# Altium project mainboard.PrjPcb
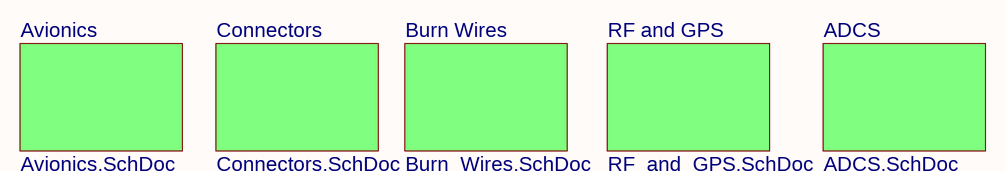
[diagram p0: mainboard.SchDoc]
6 sheets, 87 parts. Net scope: flat (ports and power ports of the same name join across sheets).
Board file: mainboard.PcbDoc
Sheets:
  mainboard.SchDoc
    Avionics = Avionics.SchDoc
    Connectors = Connectors.SchDoc
    Burn Wires = Burn_Wires.SchDoc
    RF and GPS = RF_and_GPS.SchDoc
    ADCS = ADCS.SchDoc

## Sheet mainboard.SchDoc
size 297 x 210 mm

### Sub-sheets
ADCS = ADCS.SchDoc: no entries
Avionics = Avionics.SchDoc: no entries
Burn Wires = Burn_Wires.SchDoc: no entries
Connectors = Connectors.SchDoc: no entries
RF and GPS = RF_and_GPS.SchDoc: no entries

### Notes on the sheet
- 1
- 2
- 3
- 4
- 5
- 6
- A
- B
- C
- D
- Title: PyCubed Mainboard
- File: mainboard.sch
- Sheet: /
- Max Holliday
- KiCad E.D.A.  kicad (5.1.4)-1
- Size: A4
- Date: 2020-02-10
- Rev: v04
- Id: 1/6

## Sheet Avionics.SchDoc
size 297 x 210 mm
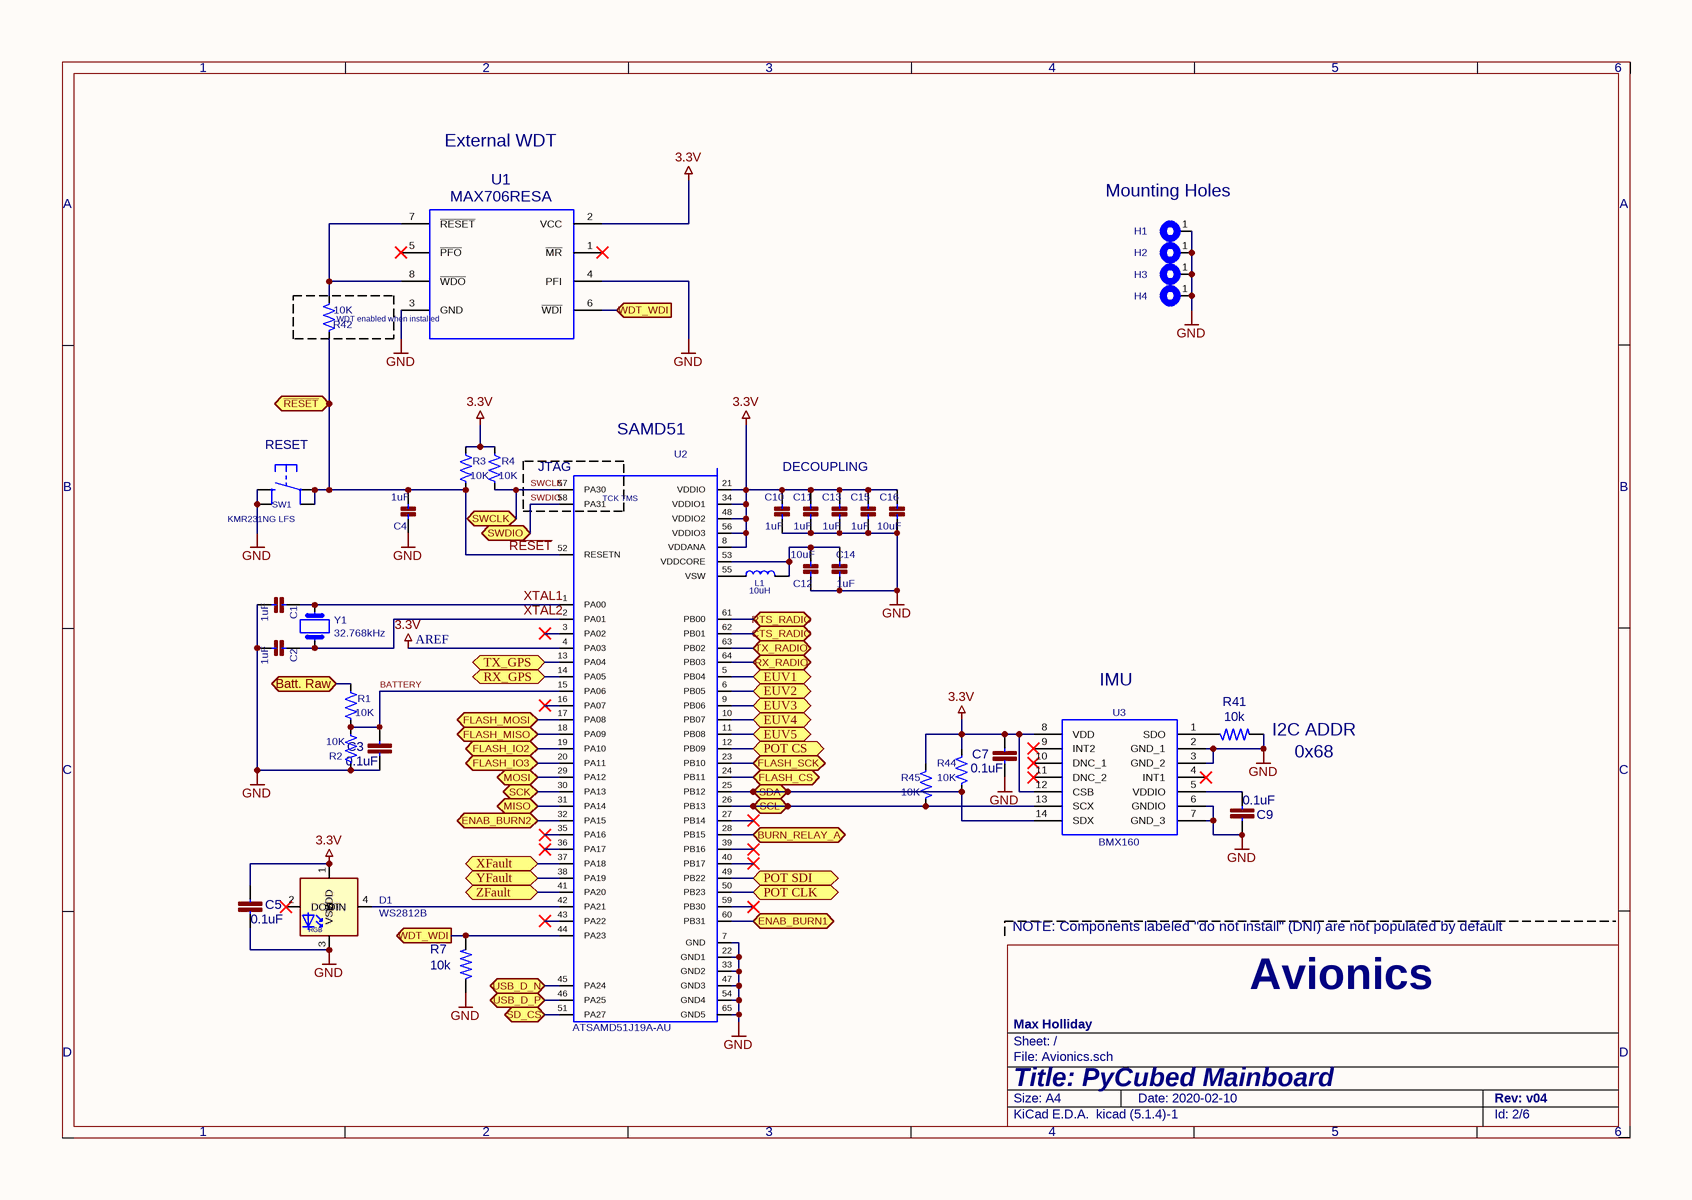
[diagram p1: Avionics.SchDoc]

### Parts
C1  1uF  [C_0603_1608Metric]
C2  1uF  [C_0603_1608Metric]
C3  0.1uF  [C_0603_1608Metric]
C4  1uF  [C_0603_1608Metric]
C5  0.1uF  [C_0603_1608Metric]
C7  0.1uF  [C_0603_1608Metric]
C9  0.1uF  [C_0603_1608Metric]
C10  1uF  [C_0603_1608Metric]
C11  1uF  [C_0603_1608Metric]
C12  10uF  [C_0603_1608Metric]
C13  1uF  [C_0603_1608Metric]
C14  1uF  [C_0603_1608Metric]
C15  1uF  [C_0603_1608Metric]
C16  10uF  [C_0603_1608Metric]
D1  WS2812B  [LED_WS2812B_PLCC4_5.0x5.0mm_P3.2mm]
H1  MountingHole_Pad  [MountingHole_3.2mm_M3_DIN965_Pad]  (value not drawn)  (no BOM)
H2  MountingHole_Pad  [MountingHole_3.2mm_M3_DIN965_Pad]  (value not drawn)  (no BOM)
H3  MountingHole_Pad  [MountingHole_3.2mm_M3_DIN965_Pad]  (value not drawn)  (no BOM)
H4  MountingHole_Pad  [MountingHole_3.2mm_M3_DIN965_Pad]  (value not drawn)  (no BOM)
L1  10uH  [L_0805_2012Metric_Pad1.15x1.40mm_HandSolder]
R1  10K  [R_0603_1608Metric]
R2  10K  [R_0603_1608Metric]
R3  10K  [R_0603_1608Metric]
R4  10K  [R_0603_1608Metric]
R7  10k  [R_0603_1608Metric]
R41  10k  [R_0603_1608Metric]
R42  10K  [R_0603_1608Metric]
R44  10K  [R_0603_1608Metric]
R45  10K  [R_0603_1608Metric]
SW1  KMR231NG LFS  [BTN_KMR2_4.6X2.8]
U1  MAX706RESA  [SO-8_3.9x4.9mm_P1.27mm]
U2  Proto: ATSAMD51J19A-AU  [ATSAMD51J19A-MU]  (hidden comment: 120MHZ 512KB Flash 64 TQFP)
U3  BMX160  [BMX160]
Y1  32.768kHz  [Crystal_SMD_3215-2Pin_3.2x1.5mm]

### Blocks framed on the sheet
WDT enabled / when installed: R42

### Ports
Batt. Raw (bidir), BURN_RELAY_A (bidir), CTS_RADIO (bidir), ENAB_BURN1 (bidir), ENAB_BURN2 (bidir), EUV1 (bidir), EUV2 (bidir), EUV3 (bidir), EUV4 (bidir), EUV5 (bidir), FLASH_CS (bidir), FLASH_IO2 (bidir), FLASH_IO3 (bidir), FLASH_MISO (bidir), FLASH_MOSI (bidir), FLASH_SCK (bidir), MISO (bidir), MOSI (bidir), POT CLK (bidir), POT CS (bidir), POT SDI (bidir), RTS_RADIO (bidir), RX_GPS (bidir), RX_RADIO (bidir), SCK (bidir), SCL (bidir), SD_CS (bidir), SDA (bidir), SWCLK (bidir), SWDIO (bidir), TX_GPS (bidir), TX_RADIO (bidir), USB_D_N (bidir), USB_D_P (bidir), WDT_WDI (in), WDT_WDI (out), XFault (bidir), YFault (bidir), ZFault (bidir), ~{RESET} (bidir)

### Nets
3.3V: C5.1 C7.1 C10.1 C11.1 C13.1 C15.1 C16.1 D1.1(VDD) R3.1 R4.1 R44.1 R45.1 U1.2(VCC) U2.4(PA03) U2.8(VDDANA) U2.21(VDDIO) U2.34(VDDIO1) U2.48(VDDIO2) U2.56(VDDIO3) U3.8(VDD) U3.12(CSB)
GND: C1.2 C2.2 C3.2 C4.1 C5.2 C7.2 C9.1 C10.2 C11.2 C12.1 C13.2 C14.2 C15.2 C16.2 D1.3(VSS) H1.1 H2.1 H3.1 H4.1 R2.1 R7.1 R41.2 SW1.B(S) SW1.B'(S1) U1.3(GND) U1.4(PFI) U2.7(GND) U2.22(GND1) U2.33(GND2) U2.47(GND3) U2.54(GND4) U2.65(GND5) U3.2(GND_1) U3.3(GND_2) U3.6(GNDIO) U3.7(GND_3)
Batt. Raw: R1.1 ; port Batt. Raw
BATTERY: C3.1 R1.2 R2.2 U2.15(PA06)
BURN_RELAY_A: U2.28(PB15) ; port BURN_RELAY_A
CTS_RADIO: U2.62(PB01) ; port CTS_RADIO
ENAB_BURN1: U2.60(PB31) ; port ENAB_BURN1
ENAB_BURN2: U2.32(PA15) ; port ENAB_BURN2
EUV5: U2.11(PB08) ; port EUV5
FLASH_CS: U2.24(PB11) ; port FLASH_CS
FLASH_IO2: U2.19(PA10) ; port FLASH_IO2
FLASH_IO3: U2.20(PA11) ; port FLASH_IO3
FLASH_MISO: U2.18(PA09) ; port FLASH_MISO
FLASH_MOSI: U2.17(PA08) ; port FLASH_MOSI
FLASH_SCK: U2.23(PB10) ; port FLASH_SCK
GB01: U2.5(PB04) ; port EUV1
GB02: U2.6(PB05) ; port EUV2
GB03: U2.9(PB06) ; port EUV3
GB04: U2.10(PB07) ; port EUV4
MISO: U2.31(PA14) ; port MISO
MOSI: U2.29(PA12) ; port MOSI
POT CLK: U2.50(PB23) ; port POT CLK
POT CS: U2.12(PB09) ; port POT CS
POT SDI: U2.49(PB22) ; port POT SDI
~{RESET}: C4.2 R3.2 R42.1 SW1.A(P) SW1.A'(P1) U2.52(RESETN) ; port ~{RESET}
RTS_RADIO: U2.61(PB00) ; port RTS_RADIO
RX_GPS: U2.14(PA05) ; port RX_GPS
RX_RADIO: U2.64(PB03) ; port RX_RADIO
SCK: U2.30(PA13) ; port SCK
SCL: R45.2 U2.26(PB13) U3.13(SCX) ; port SCL
SD_CS: U2.51(PA27) ; port SD_CS
SDA: R44.2 U2.25(PB12) U3.14(SDX) ; port SDA
SWCLK: R4.2 U2.57(PA30) ; port SWCLK
SWDIO: U2.58(PA31) ; port SWDIO
TX_GPS: U2.13(PA04) ; port TX_GPS
TX_RADIO: U2.63(PB02) ; port TX_RADIO
USB_D_N: U2.45(PA24) ; port USB_D_N
USB_D_P: U2.46(PA25) ; port USB_D_P
WDT_WDI: R7.2 U1.6(~{WDI}) U2.44(PA23) ; port WDT_WDI
XFault: U2.37(PA18) ; port XFault
XTAL1: C1.1 U2.1(PA00) Y1.1
XTAL2: C2.1 U2.2(PA01) Y1.2
YFault: U2.38(PA19) ; port YFault
ZFault: U2.41(PA20) ; port ZFault
NetC9_2: C9.2 U3.5(VDDIO)
NetC12_2: C12.2 C14.1 L1.1 U2.53(VDDCORE)
NetD1_4: D1.4(DIN) U2.42(PA21)
NetL1_2: L1.2 U2.55(VSW)
NetR41_1: R41.1 U3.1(SDO)
NetR42_2: R42.2 U1.7(~{RESET}) U1.8(~{WDO})

Not connected (* = marked no-connect by the designer): D1 2(DOUT)*; U1 1(~{MR})* 5(~{PFO})*; U2 3(PA02)* 16(PA07)* 27(PB14)* 35(PA16)* 36(PA17)* 39(PB16)* 40(PB17)* 43(PA22)* 59(PB30)*; U3 4(INT1)* 9(INT2)* 10(DNC_1)* 11(DNC_2)*

### Notes on the sheet
- External WDT
- (near H1) Mounting Holes
- (near SW1) RESET
- (near U2) JTAG
- (near U2) TCK
  TMS
- (near U2) SAMD51
- DECOUPLING
- AREF
- (near U3) IMU
- 0x68
- (near R41) I2C ADDR
- NOTE: Components labeled "do not install" (DNI) are not populated by default
- Avionics
- 1
- 2
- 3
- 4
- 5
- 6
- A
- B
- C
- D
- Title: PyCubed Mainboard
- File: Avionics.sch
- Sheet: /
- Max Holliday
- KiCad E.D.A.  kicad (5.1.4)-1
- Size: A4
- Date: 2020-02-10
- Rev: v04
- Id: 2/6
- (in symbol WS2812B) RGB

### Library data of the parts
C1 C2 C4 C10 C11 C13-C15 = CAP_CERAMIC0603_NO-Adafruit_Feather_M4_Express-eagle-import-lab64_SAM32-rescue-SAMD-10-rescue-SAM32-rescue: MPN: CL10A105KB8NNNC; Value: 1uF; Footprint: Capacitor_SMD:C_0603_1608Metric
C3 C5 C7 C9 = 0.1UF-25V(+80_-20%)(0603): MPN: CL10B104KB8NNNL; Value: 0.1uF; Footprint: Capacitor_SMD:C_0603_1608Metric
C12 C16 = CAP_CERAMIC0805-NOOUTLINE-Adafruit_Feather_M4_Express-eagle-import-lab64_SAM32-rescue-SAMD-10-rescue-SAM32-rescue: MPN: CL10A106MP8NNNC; Value: 10uF; Footprint: Capacitor_SMD:C_0603_1608Metric
D1 = WS2812B: MPN: COM-16347; Proto: WS2812B; Value: WS2812B; Footprint: LED_SMD:LED_WS2812B_PLCC4_5.0x5.0mm_P3.2mm
L1 = INDUCTOR-Adafruit_Feather_M4_Express-eagle-import-lab64_SAM32-rescue-SAMD-10-rescue-SAM32-rescue: MPN: LBR2012T100K; Value: 10uH; Footprint: Inductor_SMD:L_0805_2012Metric_Pad1.15x1.40mm_HandSolder
R1-R4 R42 R44 R45 = R_US: MPN: CRGCQ0603J10K; Value: 10K; Footprint: Resistor_SMD:R_0603_1608Metric
R7 R41 = R-US_R0603: MPN: RNCP0603FTD10K0; Value: 10k; Footprint: Resistor_SMD:R_0603_1608Metric
SW1 = SWITCH_TACT_SMT4.6X2.8-Adafruit_Feather_M4_Express-eagle-import-lab64_SAM32-rescue-SAMD-10-rescue-SAM32-rescue: Value: KMR231NG LFS; Footprint: Adafruit Feather M4 Express:BTN_KMR2_4.6X2.8; MPN: KMR231NG LFS
U1 = MAX708RESA-T: Proto: MAX706RESA; Value: MAX706RESA; Footprint: Package_SO:SO-8_3.9x4.9mm_P1.27mm; MPN: MAX706RESA
U2 = ATSAMD51J20A-AU-ATSAMD51J20A-AU-lab64_SAM32-rescue-lab64_SAM32-rescue-SAMD-10-rescue-SAM32-rescue: Field4: 120MHZ 512KB Flash 64 TQFP PKG inTray 85CTemp, 64 TQFP 10x10x1mm TRAY; Field5: TQFP-64 Microchip; Value: 120MHZ 512KB Flash 64 TQFP; Footprint: custom-footprints:QFP50P1200X1200X120-64N; MPN: ATSAMD51J19A-AU
Y1 = Crystal: Proto: ABS07-32.768KHZ-T; Value: 32.768kHz; Footprint: Crystal:Crystal_SMD_3215-2Pin_3.2x1.5mm; MPN: ABS07-32.768KHZ-T
H1-H4 = MountingHole_Pad: Value: MountingHole_Pad; Footprint: MountingHole:MountingHole_3.2mm_M3_DIN965_Pad
U3 = BMX160: Proto: BMX160; Value: BMX160; Footprint: custom-footprints:BMX160; MPN: BMX160

## Sheet Connectors.SchDoc
size 297 x 210 mm
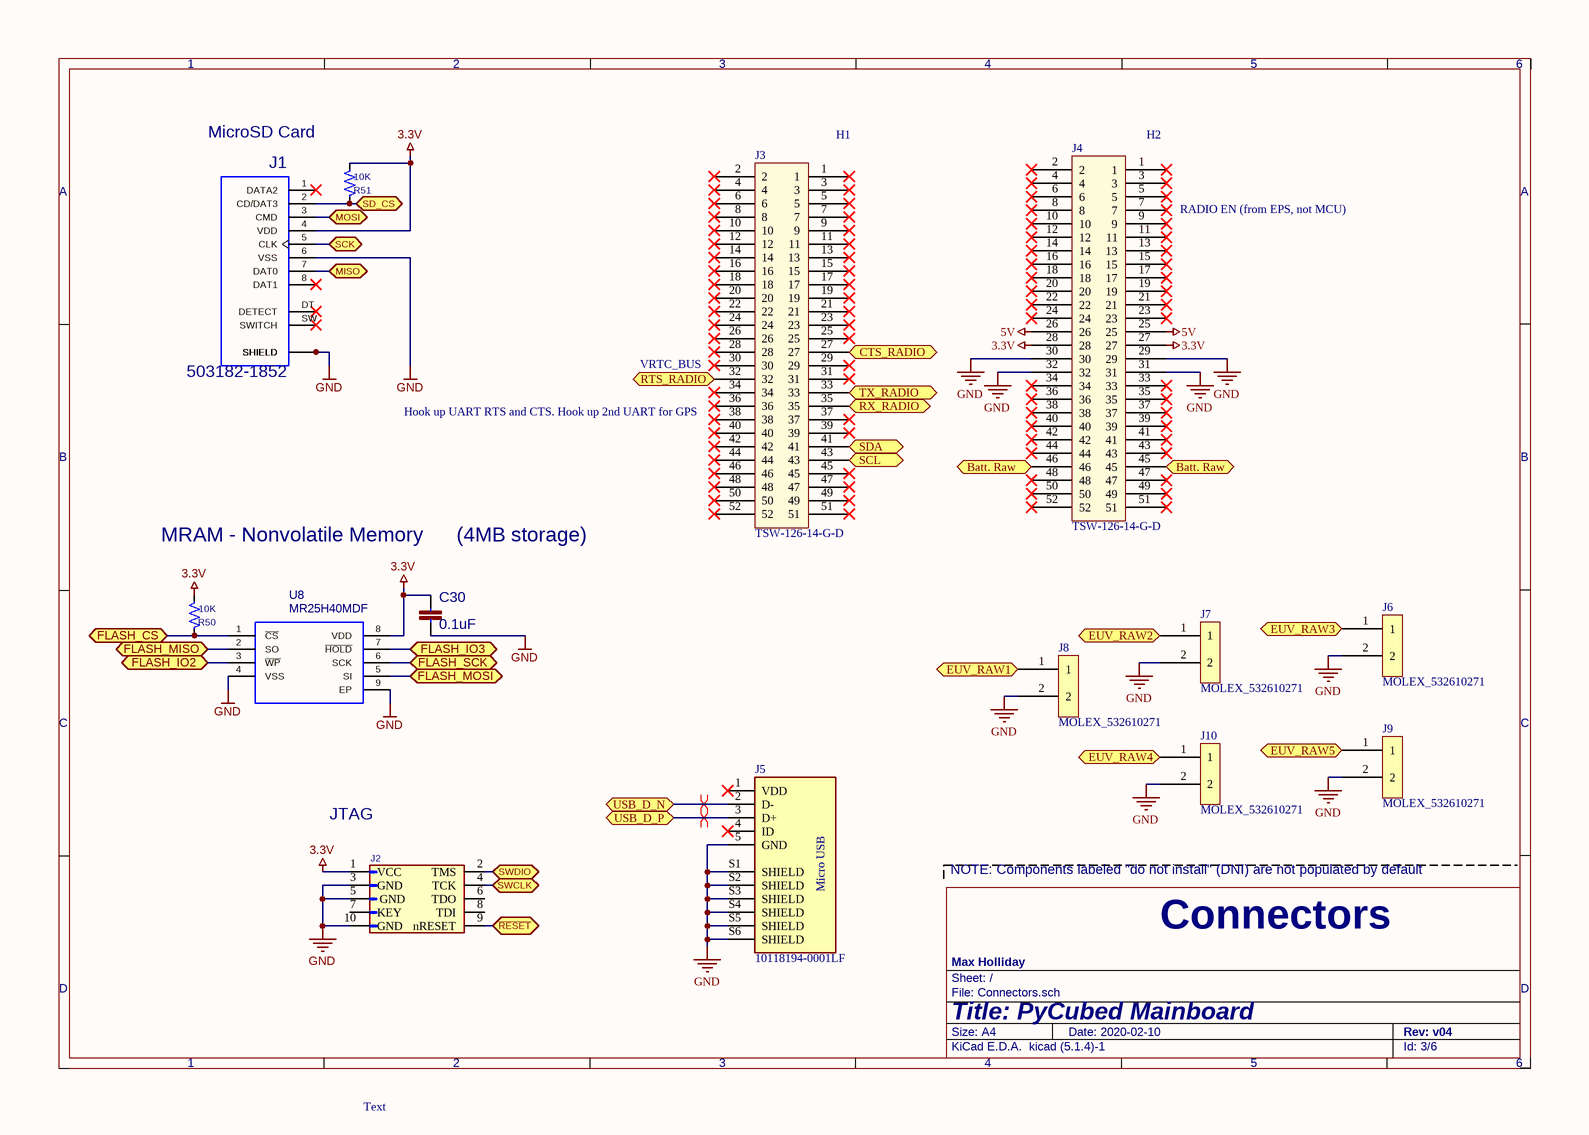
[diagram p2: Connectors.SchDoc]

### Parts
C30  0.1uF  [C_0603_1608Metric]
J1  503182-1852  [MOLEX_503182-1852]
J2  Conn_01x05  [PinHeader_1x05_P2.54mm_Vertical]  (value not drawn)  (no BOM)
J3  TSW-126-14-G-D  [SAMTEC_TSW-126-14-G-D]
J4  TSW-126-14-G-D  [SAMTEC_TSW-126-14-G-D]
J5  10118194-0001LF  [AMPHENOL_10118194-0001LF]
J6  MOLEX_532610271  [Molex_PicoBlade_532610271]
J7  MOLEX_532610271  [Molex_PicoBlade_532610271]
J8  MOLEX_532610271  [Molex_PicoBlade_532610271]
J9  MOLEX_532610271  [Molex_PicoBlade_532610271]
J10  MOLEX_532610271  [Molex_PicoBlade_532610271]
R50  10K  [R_0603_1608Metric]
R51  10K  [R_0603_1608Metric]
U8  MR25H40MDF  [SON127P600X500X90-9N]

### Ports
Batt. Raw (bidir), CTS_RADIO (bidir), EUV_RAW1 (bidir), EUV_RAW2 (bidir), EUV_RAW3 (bidir), EUV_RAW4 (bidir), EUV_RAW5 (bidir), FLASH_CS (bidir), FLASH_IO2 (bidir), FLASH_IO3 (bidir), FLASH_MISO (bidir), FLASH_MOSI (bidir), FLASH_SCK (bidir), MISO (bidir), MOSI (bidir), RTS_RADIO (bidir), RX_RADIO (bidir), SCK (bidir), SCL (bidir), SD_CS (bidir), SDA (bidir), SWCLK (bidir), SWDIO (bidir), TX_RADIO (bidir), USB_D_N (bidir), USB_D_P (bidir), ~{RESET} (bidir)

### Nets
3.3V: C30.1 J1.4(VDD) J2.1(VCC) J4.27 J4.28 R50.2 R51.2 U8.8(VDD)
5V: J4.25 J4.26
GND: C30.2 J1.6(VSS) J1.P1(SHIELD) J1.P2(SHIELD) J1.P3(SHIELD) J1.P4(SHIELD) J1.P5(SHIELD) J2.3(GND) J2.5(GND) J2.10(GND) J4.29 J4.30 J4.31 J4.32 J5.5(GND) J5.S1(SHIELD) J5.S2(SHIELD) J5.S3(SHIELD) J5.S4(SHIELD) J5.S5(SHIELD) J5.S6(SHIELD) J6.2 J7.2 J8.2 J9.2 J10.2 U8.4(VSS) U8.9(EP)
Batt. Raw: J4.45 J4.46 ; port Batt. Raw
CTS_RADIO: J3.27 ; port CTS_RADIO
FLASH_CS: R50.1 U8.1(~{CS}) ; port FLASH_CS
FLASH_IO2: U8.3(~{WP}) ; port FLASH_IO2
FLASH_IO3: U8.7(~{HOLD}) ; port FLASH_IO3
FLASH_MISO: U8.2(SO) ; port FLASH_MISO
FLASH_MOSI: U8.5(SI) ; port FLASH_MOSI
FLASH_SCK: U8.6(SCK) ; port FLASH_SCK
GA01: J8.1 ; port EUV_RAW1
GA02: J7.1 ; port EUV_RAW2
GA03: J6.1 ; port EUV_RAW3
GA04: J10.1 ; port EUV_RAW4
GA05: J9.1 ; port EUV_RAW5
MISO: J1.7(DAT0) ; port MISO
MOSI: J1.3(CMD) ; port MOSI
~{RESET}: J2.9(nRESET) ; port ~{RESET}
RTS_RADIO: J3.32 ; port RTS_RADIO
RX_RADIO: J3.35 ; port RX_RADIO
SCK: J1.5(CLK) ; port SCK
SCL: J3.43 ; port SCL
SD_CS: J1.2(CD/DAT3) R51.1 ; port SD_CS
SDA: J3.41 ; port SDA
SWCLK: J2.4(TCK) ; port SWCLK
SWDIO: J2.2(TMS) ; port SWDIO
TX_RADIO: J3.33 ; port TX_RADIO
USB_D_N: J5.2(D-) ; port USB_D_N
USB_D_P: J5.3(D+) ; port USB_D_P

Not connected (* = marked no-connect by the designer): J1 1(DATA2)* 8(DAT1)* DT(DETECT)* SW(SWITCH)*; J2 6(TDO) 7(KEY) 8(TDI); J3 1* 2* 3* 4* 5* 6* 7* 8* 9* 10* 11* 12* 13* 14* 15* 16* 17* 18* 19* 20* 21* 22* 23* 24* 25* 26* 28* 29* 30* 31* 34* 36* 37* 38* 39* 40* 42* 44* 45* 46* 47* 48* 49* 50* 51* 52*; J4 1* 2* 3* 4* 5* 6* 7* 8* 9* 10* 11* 12* 13* 14* 15* 16* 17* 18* 19* 20* 21* 22* 23* 24* 33* 34* 35* 36* 37* 38* 39* 40* 41* 42* 43* 44* 47* 48* 49* 50* 51* 52*; J5 1(VDD)* 4(ID)*

### Layout directives
differential pair: USB_D_N, USB_D_P

### Notes on the sheet
- MicroSD Card
- (near J3) H1
- (near J4) H2
- RADIO EN (from EPS, not MCU)
- VRTC_BUS
- (near J3) Hook up UART RTS and CTS. Hook up 2nd UART for GPS
- MRAM - Nonvolatile Memory
  (4MB storage)
- (near J2) JTAG
- NOTE: Components labeled "do not install" (DNI) are not populated by default
- Connectors
- 1
- 2
- 3
- 4
- 5
- 6
- A
- B
- C
- D
- Title: PyCubed Mainboard
- File: Connectors.sch
- Sheet: /
- Max Holliday
- KiCad E.D.A.  kicad (5.1.4)-1
- Size: A4
- Date: 2020-02-10
- Rev: v04
- Id: 3/6
- (in symbol 10118194-0001LF) Micro USB
- (in symbol Conn_01x05) Text

### Library data of the parts
C30 = 2.2UF-0603-10V-20%: MPN: CL10B104KO8NNNC; Value: 0.1uF; Footprint: Capacitor_SMD:C_0603_1608Metric
J1 = 503182-1852: MPN: 5031821852; Value: 503182-1852; Footprint: mainboard:MOLEX_503182-1852
J5 = 10118194-0001LF: Micro Usb, 2.0 Type b, Rcpt, Smt; Price: None; MPN: 10118194-0001LF; Availability: Unavailable; Value: *; Package: None
J6-J10 = Molex_PicoBlade_532610271: MPN: 532610271
R50 R51 = R_US: MPN: CRGCQ0603J10K; Value: 10K; Footprint: Resistor_SMD:R_0603_1608Metric
U8 = MR25H40MDF: Proto: W25Q80DVSNIG; Value: MR25H40MDF; Footprint: mainboard:SON127P600X500X90-9N; MPN: MR25H40MDF
J2 = Conn_01x05: Value: Conn_01x05; Footprint: Connector_PinHeader_2.54mm:PinHeader_1x05_P2.54mm_Vertical
J3 J4 = TSW-126-14-G-D: MPN: TSW-126-14-G-D

## Sheet Burn_Wires.SchDoc
size 297 x 210 mm
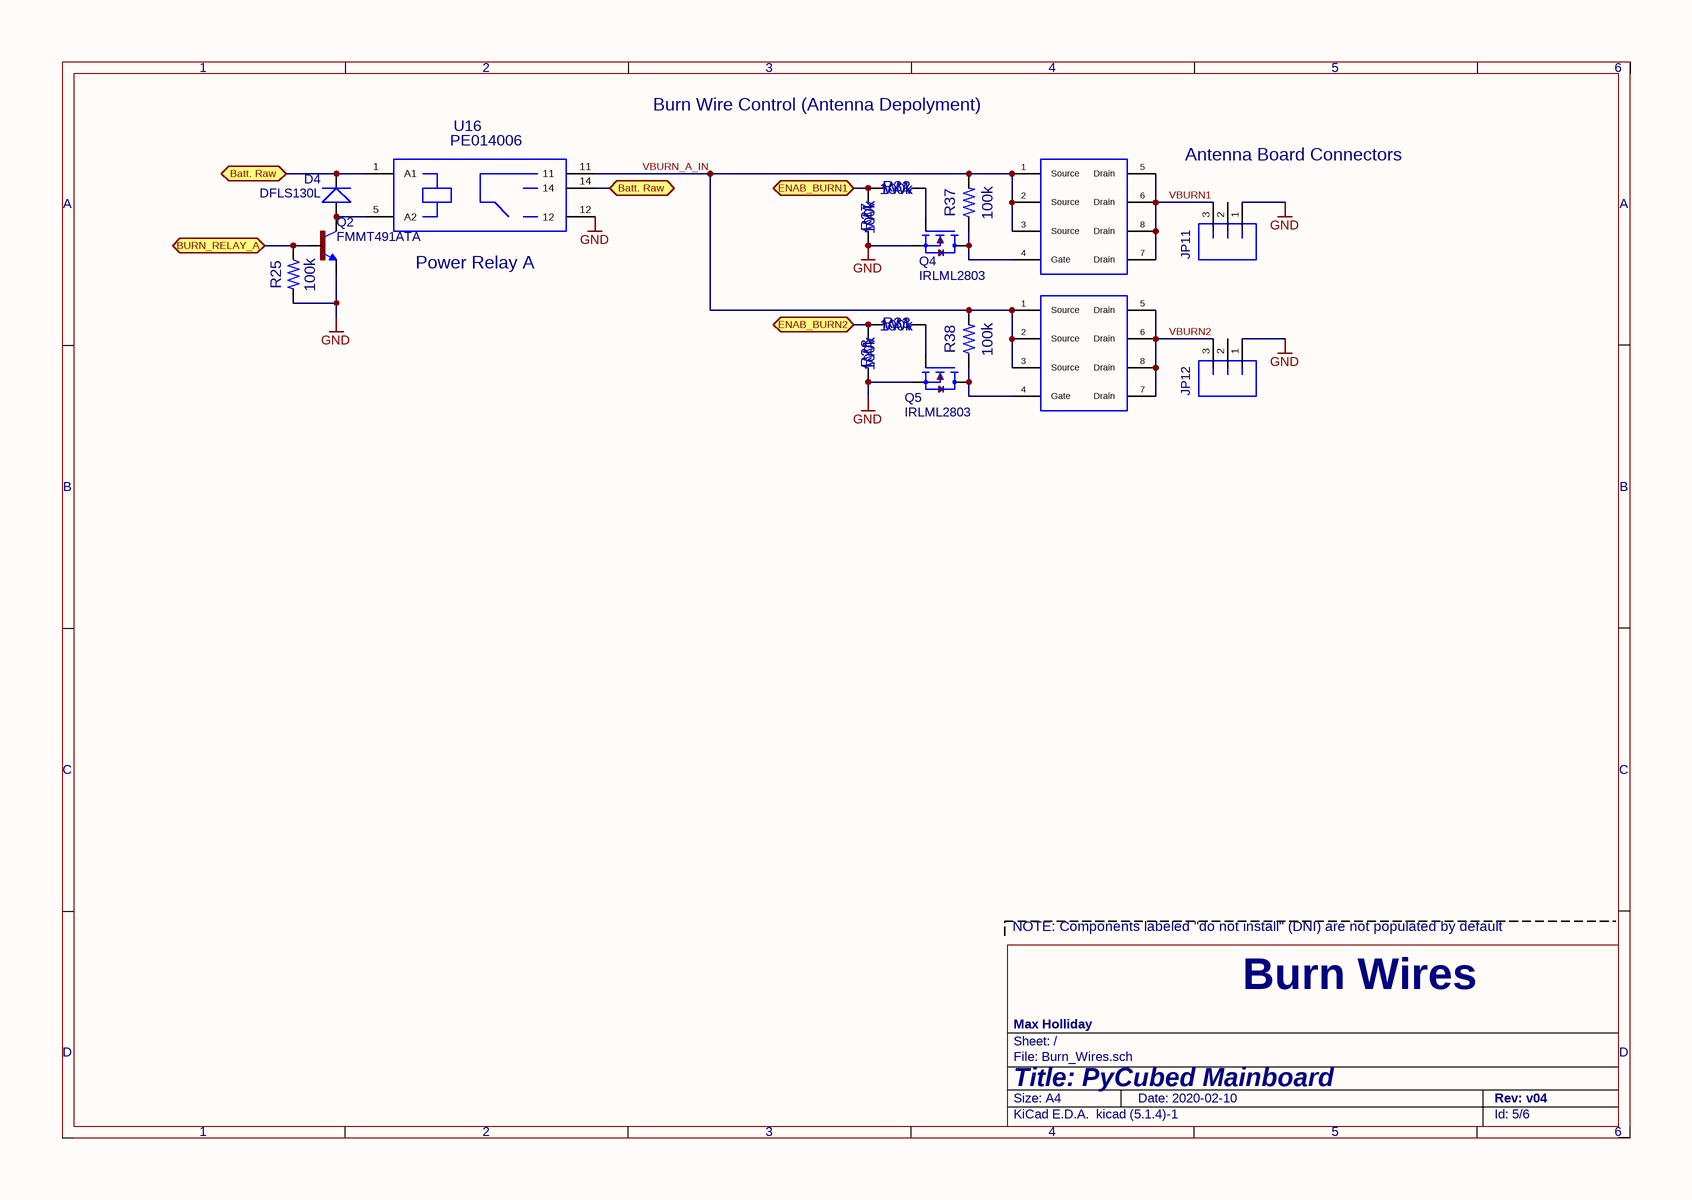
[diagram p3: Burn_Wires.SchDoc]

### Parts
D4  value DFLS130L  [PWRDI-123]  (hidden comment: SBR2A40P1Q-7)
JP11  Conn_01x03  [MOLEX-1X3_LOCK]  (value not drawn)
JP12  Conn_01x03  [MOLEX-1X3_LOCK]  (value not drawn)
Q2  FMMT491ATA  [SOT23]
Q4  IRLML2803  [SOT-23]
Q5  IRLML2803  [SOT-23]
R25  100k  [R_0603_1608Metric]
R27  100k  [R_0603_1608Metric]
R28  100k  [R_0603_1608Metric]
R32  100k  [R_0603_1608Metric]
R33  100k  [R_0603_1608Metric]
R37  100k  [R_0603_1608Metric]
R38  100k  [R_0603_1608Metric]
U16  PE014006  [RELAY5-PE_CO]
U18  NDS8434  [NDS8434]  (value not drawn)
U19  NDS8434  [NDS8434]  (value not drawn)

### Ports
Batt. Raw (bidir), BURN_RELAY_A (bidir), ENAB_BURN1 (bidir), ENAB_BURN2 (bidir)

### Nets
GND: JP11.1 JP12.1 Q2.2(E) Q4.2(S) Q5.2(S) R25.2 R27.2 R28.2 U16.12
Batt. Raw: D4.C U16.1(A1) U16.14 ; port Batt. Raw
BURN_RELAY_A: Q2.1(B) R25.1 ; port BURN_RELAY_A
ENAB_BURN1: R27.1 R32.2 ; port ENAB_BURN1
ENAB_BURN2: R28.1 R33.2 ; port ENAB_BURN2
VBURN1: JP11.3 U18.5(Drain) U18.6(Drain) U18.7(Drain) U18.8(Drain)
VBURN2: JP12.3 U19.5(Drain) U19.6(Drain) U19.7(Drain) U19.8(Drain)
VBURN_A_IN: R37.2 R38.2 U16.11 U18.1(Source) U18.2(Source) U18.3(Source) U19.1(Source) U19.2(Source) U19.3(Source)
NetD4_A: D4.A Q2.3(C) U16.5(A2)
NetQ4_1: Q4.1(G) R32.1
NetQ4_3: Q4.3(D) R37.1 U18.4(Gate)
NetQ5_1: Q5.1(G) R33.1
NetQ5_3: Q5.3(D) R38.1 U19.4(Gate)

Not connected (* = marked no-connect by the designer): JP11 2; JP12 2

### Notes on the sheet
- Burn Wire Control (Antenna Depolyment)
- Antenna Board
  Connectors
- (near U16) Power Relay A
- NOTE: Components labeled "do not install" (DNI) are not populated by default
- Burn Wires
- 1
- 2
- 3
- 4
- 5
- 6
- A
- B
- C
- D
- Title: PyCubed Mainboard
- File: Burn_Wires.sch
- Sheet: /
- Max Holliday
- KiCad E.D.A.  kicad (5.1.4)-1
- Size: A4
- Date: 2020-02-10
- Rev: v04
- Id: 5/6

### Library data of the parts
D4 = DFLS130L: Proto: DFLS130L; Footprint: mainboard:PWRDI-123; MPN: DFLS130L
JP11 JP12 = M03POLAR_LOCK: Value: Conn_01x03; Footprint: mainboard:MOLEX-1X3_LOCK
Q2 = BC846: Proto: S8050; Value: FMMT491ATA; Footprint: mainboard:SOT23; MPN: FMMT491ATA
Q4 Q5 = IRLML2803TRPBF: Proto: 2302; Value: IRLML2803; Footprint: mainboard:SOT-23; MPN: IRLML2803
R25 R27 R28 R32 R33 R37 R38 = RESISTOR0603: MPN: RC0603JR-07100KL; Value: 100k; Footprint: Resistor_SMD:R_0603_1608Metric
U16 = PE014005: MPN: PE014006 TE; Proto: JE-109D GOODSKY; Value: PE014006; Footprint: mainboard:RELAY5-PE_CO
U18 U19 = NDS8434: MPN: IRF7404TRPBF; Proto: DMP2022LSS-13; Value: NDS8434; Footprint: custom-footprints:NDS8434

## Sheet RF_and_GPS.SchDoc
size 420 x 297 mm
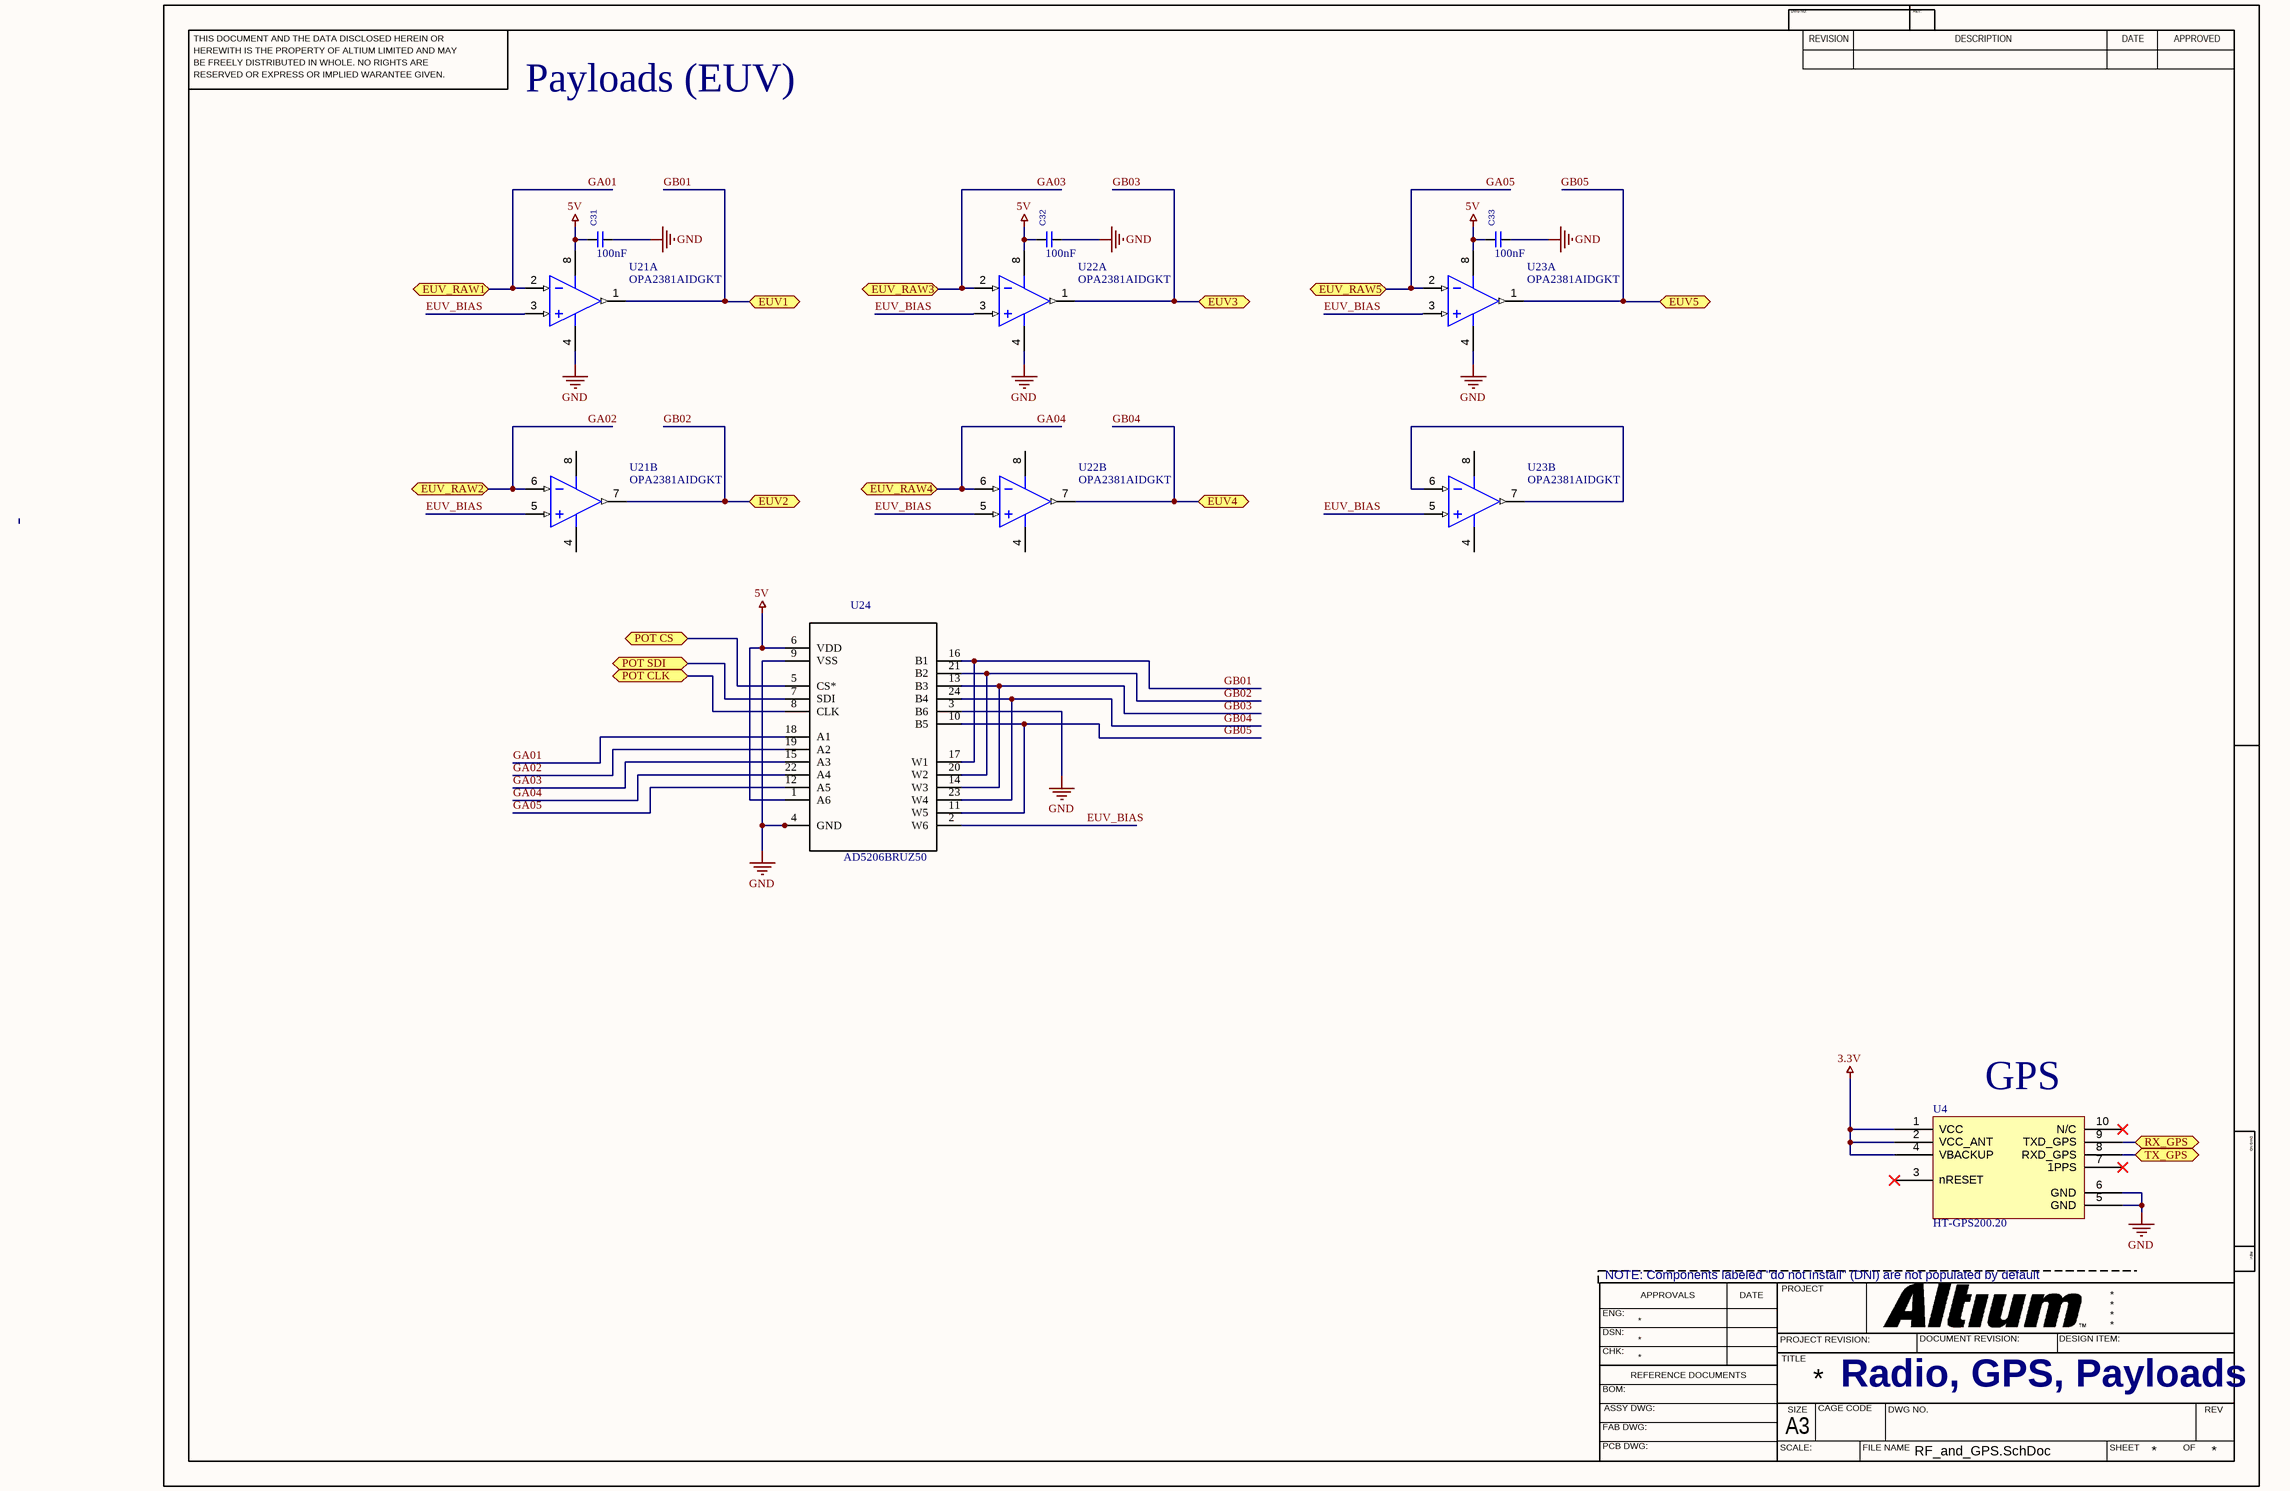
[diagram p4: RF_and_GPS.SchDoc]

### Parts
C31  100nF  [Resistor_0805]
C32  100nF  [Resistor_0805]
C33  100nF  [Resistor_0805]
U4  HT-GPS200.20  [HT-GPS200.20]
U21  OPA2381AIDGKT  [DGK0008A_N]  (parts A,B of 2)
U22  OPA2381AIDGKT  [DGK0008A_N]  (parts A,B of 2)
U23  OPA2381AIDGKT  [DGK0008A_N]  (parts A,B of 2)
U24  AD5206BRUZ50  [*SOP65P640X120-24N]

### Ports
EUV1 (bidir), EUV2 (bidir), EUV3 (bidir), EUV4 (bidir), EUV5 (bidir), EUV_RAW1 (bidir), EUV_RAW2 (bidir), EUV_RAW3 (bidir), EUV_RAW4 (bidir), EUV_RAW5 (bidir), POT CLK (bidir), POT CS (bidir), POT SDI (bidir), RX_GPS (bidir), TX_GPS (bidir)

### Nets
3.3V: U4.1(VCC) U4.2(VCC_ANT) U4.4(VBACKUP)
5V: C31.1 C32.1 C33.1 U21.8(V+) U22.8(V+) U23.8(V+) U24.1(A6) U24.6(VDD)
GND: C31.2 C32.2 C33.2 U4.5(GND) U4.6(GND) U21.4(V-) U22.4(V-) U23.4(V-) U24.3(B6) U24.4(GND) U24.9(VSS)
EUV5: U23.1(OUT_A) ; port EUV5
EUV_BIAS: U21.3(IN_A+) U21.5(IN_B+) U22.3(IN_A+) U22.5(IN_B+) U23.3(IN_A+) U23.5(IN_B+) U24.2(W6)
GA01: U21.2(IN_A-) U24.18(A1) ; port EUV_RAW1
GA02: U21.6(IN_B-) U24.19(A2) ; port EUV_RAW2
GA03: U22.2(IN_A-) U24.15(A3) ; port EUV_RAW3
GA04: U22.6(IN_B-) U24.22(A4) ; port EUV_RAW4
GA05: U23.2(IN_A-) U24.12(A5) ; port EUV_RAW5
GB01: U21.1(OUT_A) U24.16(B1) U24.17(W1) ; port EUV1
GB02: U21.7(OUT_B) U24.20(W2) U24.21(B2) ; port EUV2
GB03: U22.1(OUT_A) U24.13(B3) U24.14(W3) ; port EUV3
GB04: U22.7(OUT_B) U24.23(W4) U24.24(B4) ; port EUV4
GB05: U24.10(B5) U24.11(W5)
POT CLK: U24.8(CLK) ; port POT CLK
POT CS: U24.5(CS*) ; port POT CS
POT SDI: U24.7(SDI) ; port POT SDI
RX_GPS: U4.9(TXD_GPS) ; port RX_GPS
TX_GPS: U4.8(RXD_GPS) ; port TX_GPS
NetU23_6: U23.6(IN_B-) U23.7(OUT_B)

Not connected (* = marked no-connect by the designer): U4 3(nRESET)* 7(1PPS)* 10(N/C)*

### Notes on the sheet
- Payloads (EUV)
- (near U4) GPS
- NOTE: Components labeled "do not install" (DNI) are not populated by default
- Radio, GPS, Payloads
- Labels drawn without touching a wire or pin: GB05
- THIS DOCUMENT AND THE DATA DISCLOSED HEREIN OR
- HEREWITH IS THE PROPERTY OF ALTIUM LIMITED AND MAY
- DWG NO:
- REVISION
- REV:
- DESCRIPTION
- DATE
- APPROVED
- BE FREELY DISTRIBUTED IN WHOLE. NO RIGHTS ARE
- RESERVED OR EXPRESS OR IMPLIED WARANTEE GIVEN.
- ENG:
- APPROVALS
- PROJECT
- DSN:
- CHK:
- REFERENCE DOCUMENTS
- PROJECT REVISION:
- TITLE
- DOCUMENT REVISION:
- DESIGN ITEM:
- BOM:
- FAB DWG:
- PCB DWG:
- ASSY DWG:
- SCALE:
- A3
- SIZE
- CAGE CODE
- FILE NAME
- DWG NO.
- SHEET
- OF
- REV

### Library data of the parts
C31-C33 = CL21B104KBCNNNC: MPN: CL21B104KBCNNNC
U4 = HT-GPS200.20: HT-GPS200.20 GNSS module
U21-U23 = CMP-0272-01137-3: Precision, Low Power, Transimpedance Amplifier, 2.7 to 5 V, -40 to 125 degC, 8-pin SOP (DGK8), Green (RoHS & no Sb/Br); Manufacturer: Texas Instruments; Offset Drift(Typ)(uV/C): 0.03; Number of Channels: 2; Total Supply Voltage(Min)(+5V is 5, +/-5V is 10): 2.7; Slew Rate(Typ)(V/us): 12; CMRR(Min)(dB): 95; Sub Family: Low Offset Voltage Amplifier (<=500uV), Low Supply Voltage Amplifier (<=2.7V), Precision Amplifier; Iq per channel(Max)(mA): 1; Vio (25C)(Max)(mV): 0.025; IIB(Max)(pA): 50; Total Supply Voltage(Max)(+5V is 5, +/-5V is 10): 5; PackageVersion: 4073329/E, 05/2006; Code_JEDEC: MO-187; Mounting Technology: Surface Mount; PackageReference: DGK0008A; ComponentLink1URL: http://www.ti.com/; Eco-Plan: Green (RoHS & no Sb/Br); ComponentLink2URL: http://www.ti.com/general/docs/lit/getliterature.tsp?genericPartNumber=OPA2381&fileType=pdf; ComponentLink3URL: http://www.ti.com/litv/pdf/mpds028d; ComponentLink2Description: Datasheet; PackageDescription: 8-Pin Thin Small Outline, Body 3 x 3 mm, Pitch 0.65 mm; ComponentLink3Description: Package Specification; PartNumber: OPA2381AIDGKT; DatasheetVersion: SBOS313B; ComponentLink1Description: Manufacturer URL
U24 = AD5206BRUZ50: Check_prices: https://www.snapeda.com/parts/AD5206BRUZ50/Analog+Devices/view-part/?ref=eda; SnapEDA_Link: https://www.snapeda.com/parts/AD5206BRUZ50/Analog+Devices/view-part/?ref=snap; Value: *

## Sheet ADCS.SchDoc
size A; SPICEModelCacheWDEDLVVZ: <root> / <DocumentId>WDEDLVVZ</DocumentId> / </root>
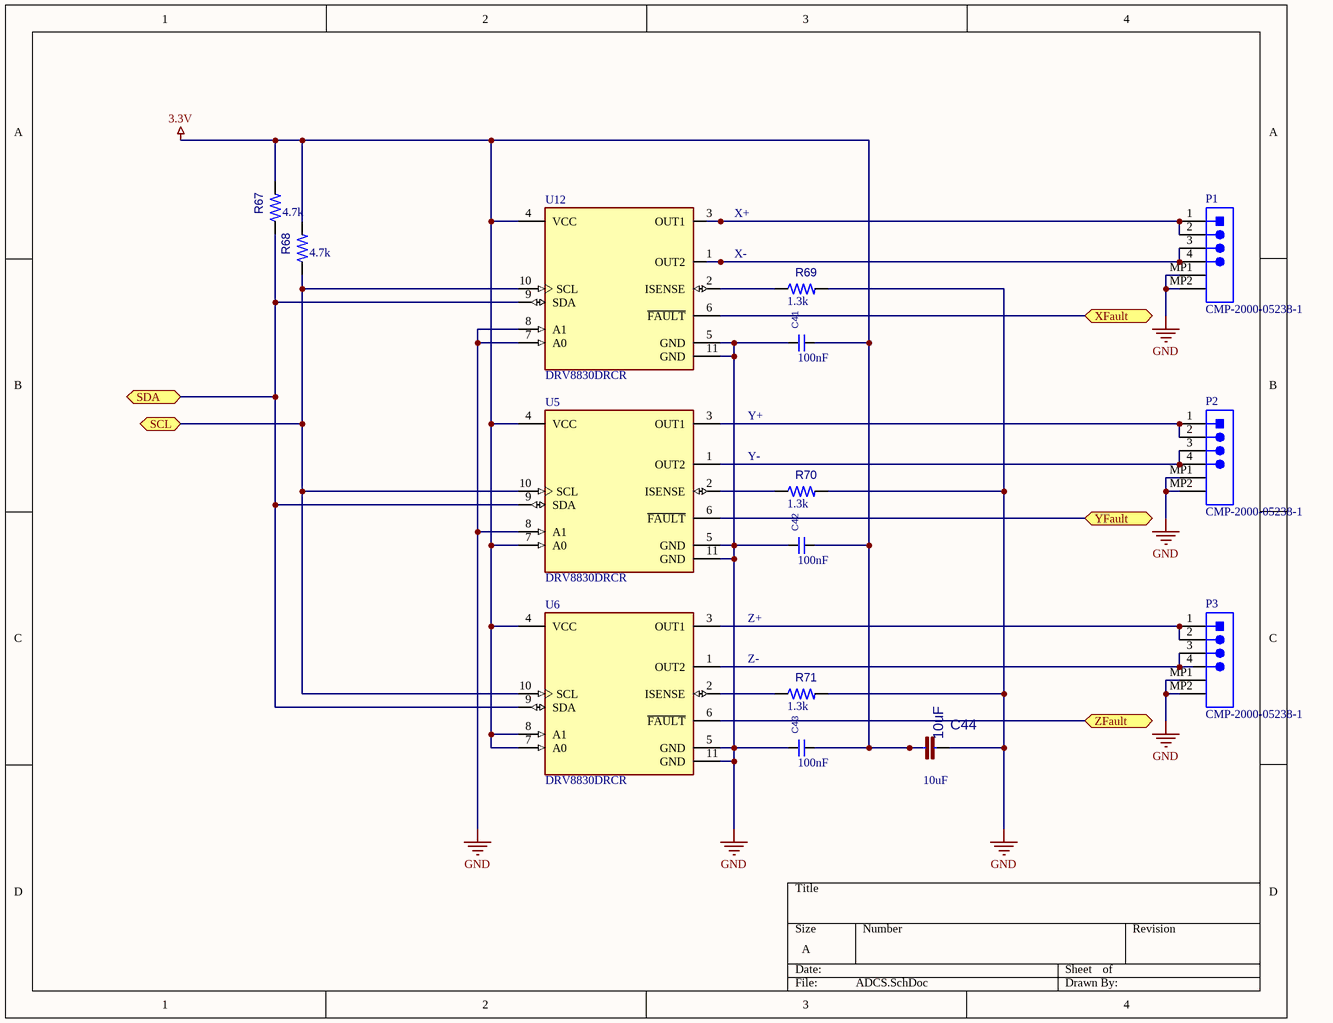
[diagram p5: ADCS.SchDoc]

### Parts
C41  100nF  [Resistor_0805]
C42  100nF  [Resistor_0805]
C43  100nF  [Resistor_0805]
C44  10uF  [C_0603_1608Metric]
P1  CMP-2000-05238-1  [MOLEX-53261-0471_V]
P2  CMP-2000-05238-1  [MOLEX-53261-0471_V]
P3  CMP-2000-05238-1  [MOLEX-53261-0471_V]
R67  4.7k  [L_0805_2012Metric_Pad1.15x1.40mm_HandSolder]
R68  4.7k  [L_0805_2012Metric_Pad1.15x1.40mm_HandSolder]
R69  1.3k  [L_0805_2012Metric_Pad1.15x1.40mm_HandSolder]
R70  1.3k  [L_0805_2012Metric_Pad1.15x1.40mm_HandSolder]
R71  1.3k  [L_0805_2012Metric_Pad1.15x1.40mm_HandSolder]
U5  DRV8830DRCR  [FP-DRC0010J-MFG]
U6  DRV8830DRCR  [FP-DRC0010J-MFG]
U12  DRV8830DRCR  [FP-DRC0010J-MFG]

### Ports
SCL (bidir), SDA (bidir), XFault (bidir), YFault (bidir), ZFault (bidir)

### Nets
3.3V: C41.2 C42.2 C43.2 C44.1 R67.2 R68.2 U5.4(VCC) U5.7(A0) U6.4(VCC) U6.7(A0) U6.8(A1) U12.4(VCC)
GND: C41.1 C42.1 C43.1 C44.2 P1.MP1 P1.MP2 P2.MP1 P2.MP2 P3.MP1 P3.MP2 R69.2 R70.2 R71.2 U5.5(GND) U5.8(A1) U5.11(GND) U6.5(GND) U6.11(GND) U12.5(GND) U12.7(A0) U12.8(A1) U12.11(GND)
SCL: R68.1 U5.10(SCL) U6.10(SCL) U12.10(SCL) ; port SCL
SDA: R67.1 U5.9(SDA) U6.9(SDA) U12.9(SDA) ; port SDA
XFault: U12.6(~{FAULT}) ; port XFault
YFault: U5.6(~{FAULT}) ; port YFault
ZFault: U6.6(~{FAULT}) ; port ZFault
NetP1_1: P1.1 P1.2 U12.3(OUT1)
NetP1_3: P1.3 P1.4 U12.1(OUT2)
NetP2_1: P2.1 P2.2 U5.3(OUT1)
NetP2_3: P2.3 P2.4 U5.1(OUT2)
NetP3_1: P3.1 P3.2 U6.3(OUT1)
NetP3_3: P3.3 P3.4 U6.1(OUT2)
NetR69_1: R69.1 U12.2(ISENSE)
NetR70_1: R70.1 U5.2(ISENSE)
NetR71_1: R71.1 U6.2(ISENSE)

### Notes on the sheet
- (near U12) X+
- X-
- Y+
- Y-
- Z+
- Z-

### Library data of the parts
C41-C43 = CL21B104KBCNNNC: MPN: CL21B104KBCNNNC
C44 = 1210ZC106KAT2A: Footprint: Capacitor_SMD:C_0603_1608Metric; MPN: 1210ZC106KAT2A; Value: 10uF
P1-P3 = CMP-2000-05238-1: Male Header, Pitch 1.25 mm, 1 x 4 Position, Height 3.4 mm, -40 to 85 degC, RoHS, Tape and Reel; MPN: 0533984004; Supplier 1: Digi-Key
R67 R68 = RC0805FR-074K7L: MPN: RC0805FR-074K7L
R69-R71 = ERJ-6ENF1301V: MPN: ERJ-6ENF1301V
U5 U6 U12 = CMP-04915-000001-1: IC MTRDRV BIPLR 2.75-6.8V 10VSON; Manufacturer: Texas Instruments; Switching Frequency: 44.5kHz; Standoff Height: 0mm; Nominal Supply Current: 1.4mA; Max Junction Temp: +150°C; Number Of Outputs: 1; Min Supply Voltage: 2.75V; Motor Type: Brushed; Max Supply Voltage: 6.8V; Output Current: 1A; Automotive: No; Temperature: -40°C to +85°C; ComponentLink2Description: Datasheet; Package: DRC0010J; Octopart: https://octopart.com/drv8830drcr-texas+instruments-21221812; Device Class L3: Motor Drivers; Height: 1mm; Lead Free: Yes; Device Class L2: Power Management ICs; Mouser Description: 1A Low Voltage Brushed DC Motor Driver with Speed Regulation (I2C Ctrl) 10-VSON -40 to 85; MPN: DRV8830DRCR; Temperature Range High: +85°C; ComponentLink2URL: http://www.ti.com/lit/ds/symlink/drv8830.pdf; Category: IC; RoHS: TRUE; Device Class L1: Integrated Circuits (ICs); Digikey Description: IC MTRDRV BIPLR 2.75-6.8V 10VSON; Temperature Range Low: -40°C

## Nets that join several sheets
3.3V: Avionics (21 pins), Connectors (8 pins), RF_and_GPS (U4.1 U4.2 U4.4), ADCS (12 pins)
5V: Connectors (J4.25 J4.26), RF_and_GPS (8 pins)
GND: Avionics (36 pins), Connectors (28 pins), Burn_Wires (9 pins), RF_and_GPS (11 pins), ADCS (22 pins)
Batt. Raw: Avionics (R1.1), Connectors (J4.45 J4.46), Burn_Wires (D4.C U16.1 U16.14)
BURN_RELAY_A: Avionics (U2.28), Burn_Wires (Q2.1 R25.1)
CTS_RADIO: Avionics (U2.62), Connectors (J3.27)
ENAB_BURN1: Avionics (U2.60), Burn_Wires (R27.1 R32.2)
ENAB_BURN2: Avionics (U2.32), Burn_Wires (R28.1 R33.2)
EUV5: Avionics (U2.11), RF_and_GPS (U23.1)
FLASH_CS: Avionics (U2.24), Connectors (R50.1 U8.1)
FLASH_IO2: Avionics (U2.19), Connectors (U8.3)
FLASH_IO3: Avionics (U2.20), Connectors (U8.7)
FLASH_MISO: Avionics (U2.18), Connectors (U8.2)
FLASH_MOSI: Avionics (U2.17), Connectors (U8.5)
FLASH_SCK: Avionics (U2.23), Connectors (U8.6)
GA01: Connectors (J8.1), RF_and_GPS (U21.2 U24.18)
GA02: Connectors (J7.1), RF_and_GPS (U21.6 U24.19)
GA03: Connectors (J6.1), RF_and_GPS (U22.2 U24.15)
GA04: Connectors (J10.1), RF_and_GPS (U22.6 U24.22)
GA05: Connectors (J9.1), RF_and_GPS (U23.2 U24.12)
GB01: Avionics (U2.5), RF_and_GPS (U21.1 U24.16 U24.17)
GB02: Avionics (U2.6), RF_and_GPS (U21.7 U24.20 U24.21)
GB03: Avionics (U2.9), RF_and_GPS (U22.1 U24.13 U24.14)
GB04: Avionics (U2.10), RF_and_GPS (U22.7 U24.23 U24.24)
MISO: Avionics (U2.31), Connectors (J1.7)
MOSI: Avionics (U2.29), Connectors (J1.3)
POT CLK: Avionics (U2.50), RF_and_GPS (U24.8)
POT CS: Avionics (U2.12), RF_and_GPS (U24.5)
POT SDI: Avionics (U2.49), RF_and_GPS (U24.7)
~{RESET}: Avionics (6 pins), Connectors (J2.9)
RTS_RADIO: Avionics (U2.61), Connectors (J3.32)
RX_GPS: Avionics (U2.14), RF_and_GPS (U4.9)
RX_RADIO: Avionics (U2.64), Connectors (J3.35)
SCK: Avionics (U2.30), Connectors (J1.5)
SCL: Avionics (R45.2 U2.26 U3.13), Connectors (J3.43), ADCS (R68.1 U5.10 U6.10 U12.10)
SD_CS: Avionics (U2.51), Connectors (J1.2 R51.1)
SDA: Avionics (R44.2 U2.25 U3.14), Connectors (J3.41), ADCS (R67.1 U5.9 U6.9 U12.9)
SWCLK: Avionics (R4.2 U2.57), Connectors (J2.4)
SWDIO: Avionics (U2.58), Connectors (J2.2)
TX_GPS: Avionics (U2.13), RF_and_GPS (U4.8)
TX_RADIO: Avionics (U2.63), Connectors (J3.33)
USB_D_N: Avionics (U2.45), Connectors (J5.2)
USB_D_P: Avionics (U2.46), Connectors (J5.3)
XFault: Avionics (U2.37), ADCS (U12.6)
YFault: Avionics (U2.38), ADCS (U5.6)
ZFault: Avionics (U2.41), ADCS (U6.6)